# Altium schematic sheet Voltage Measurement.SchDoc
size A3
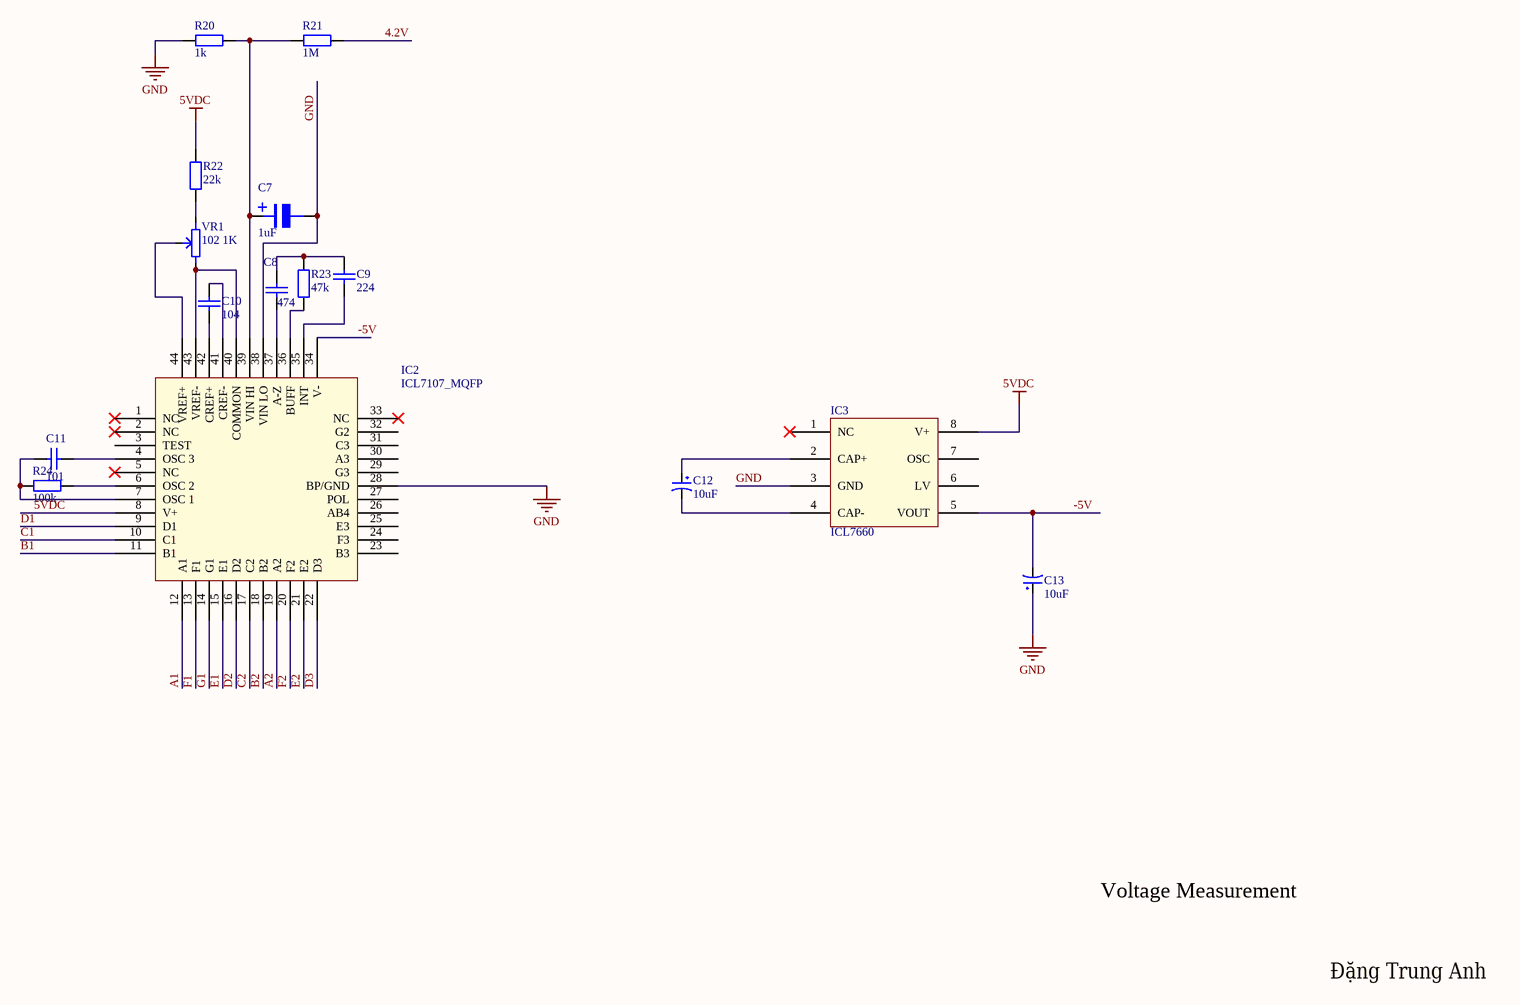
[diagram p0: Voltage Measurement.SchDoc]

## Parts
C7  1uF  [tu nhom 4 (B)]
C8  474  [tu 0805]
C9  224  [tu 0805]
C10  104  [tu 0805]
C11  101  [tu 0805]
C12  10uF  [tu hoa 4mm]
C13  10uF  [tu hoa 4mm]
IC2  ICL7107_MQFP  [ICL7107_MQFP44]
IC3  ICL7660  [SOIC8_ICL7660]
R20  1k  [tro smd 0805]
R21  1M  [tro smd 0805]
R22  22k  [tro smd 0805]
R23  47k  [tro smd 0805]
R24  100k  [tro smd 0805]
VR1  102 1K  [VR Tam Giac]

## Nets
5VDC: IC2.8(V+) IC3.8(V+) R22.2
GND: C7.2 C13.1 IC2.28(BP/GND) IC2.38(VIN_LO) IC3.3(GND) R20.2
4.2V: R21.1
-5V: C13.2 IC2.34(V-) IC3.5(VOUT)
A1: IC2.12(A1)
A2: IC2.19(A2)
B1: IC2.11(B1)
B2: IC2.18(B2)
C1: IC2.10(C1)
C2: IC2.17(C2)
D1: IC2.9(D1)
D2: IC2.16(D2)
D3: IC2.22(D3)
E1: IC2.15(E1)
E2: IC2.21(E2)
F1: IC2.13(F1)
F2: IC2.20(F2)
G1: IC2.14(G1)
NetC7_1: C7.1 IC2.39(VIN_HI) R20.1 R21.2
NetC8_1: C8.1 C9.1 R23.2
NetC8_2: C8.2 IC2.37(A-Z)
NetC9_2: C9.2 IC2.35(INT)
NetC10_1: C10.1 IC2.42(CREF+)
NetC10_2: C10.2 IC2.41(CREF-)
NetC11_1: C11.1 IC2.4(OSC_3)
NetC11_2: C11.2 IC2.7(OSC_1) R24.1
NetC12_1: C12.1 IC3.2(CAP+)
NetC12_2: C12.2 IC3.4(CAP-)
NetIC2_6: IC2.6(OSC_2) R24.2
NetIC2_36: IC2.36(BUFF) R23.1
NetIC2_40: IC2.40(COMMON) IC2.43(VREF-) VR1.1
NetIC2_44: IC2.44(VREF+) VR1.2
NetR22_1: R22.1 VR1.3

Not connected (* = marked no-connect by the designer): IC2 1(NC)* 2(NC)* 3(TEST) 5(NC)* 23(B3) 24(F3) 25(E3) 26(AB4) 27(POL) 29(G3) 30(A3) 31(C3) 32(G2) 33(NC)*; IC3 1(NC)* 6(LV) 7(OSC)

## Notes on the sheet
- Voltage Measurement
- Đặng Trung Anh
- (in symbol Tu Nhom 1uF 50V) +

## Library data of the parts
C7 = Tu Nhom 1uF 50V: Dán; Don_Vi: Con; So_Chan: 2; Ten_Linh_Kien: Tụ Nhôm 1uF 50V 4x5.4MM; Ma_Hang: MH007467; Chung_Loai: Dán; Kieu_Chan: *
C8 = Tu 0805 474 50V 10%: Dán; Don_Vi: Con; So_Chan: 2; Ten_Linh_Kien: Tụ 0805 474-470nF 50V 10%; Ma_Hang: MH006116; Chung_Loai: Dán; Kieu_Chan: *
C9 = Tu 0805 224 50V 10%: Dán; Don_Vi: Con; So_Chan: 2; Ten_Linh_Kien: Tụ 0805 224-0.22uF 10% 50V; Ma_Hang: MH004559; Chung_Loai: Dán; Kieu_Chan: *
C10 = Tu 0805 104 50V 10%: Dán; Don_Vi: Con; So_Chan: 2; Ten_Linh_Kien: Tụ 0805 104-100nF 10% 50V; Ma_Hang: MH004551; Chung_Loai: Dán; Kieu_Chan: *
C11 = Tu 0805 101 50V 20%: Dán; Don_Vi: Con; So_Chan: 2; Ten_Linh_Kien: Tụ 0805 101-0.1nF 50V 20%; Ma_Hang: MH002806; Chung_Loai: Dán; Kieu_Chan: *
C12 C13 = Tu Hoa 10uF 25V 4x7: Cắm; So_Chan: 2; Ten_Linh_Kien: Tụ Hóa 10uF 25V 4x7MM; Don_Vi: Con; Ma_Hang: MH001349; Chung_Loai: Cắm; Kieu_Chan: *
IC3 = ICL7660_SOIC8
R20 = Tro 0805 5% 1k: Dán; Don_Vi: Con; So_Chan: 2; Ten_Linh_Kien: Trở 0805 5% 1k; Ma_Hang: MH005234; Chung_Loai: Dán; Kieu_Chan: *
R21 = Tro 0805 5% 1M: Dán; Don_Vi: Con; So_Chan: 2; Ten_Linh_Kien: Trở 0805 5% 1M; Ma_Hang: MH005235; Chung_Loai: Dán; Kieu_Chan: *
R22 = Tro 0805 5% 22k: Dán; Don_Vi: Con; So_Chan: 2; Ten_Linh_Kien: Trở 0805 5% 22k; Ma_Hang: MH005248; Chung_Loai: Dán; Kieu_Chan: *
R23 = Tro 0805 5% 47k: Dán; Don_Vi: Con; So_Chan: 2; Ten_Linh_Kien: Trở 0805 5% 47k; Ma_Hang: MH005320; Chung_Loai: Dán; Kieu_Chan: *
R24 = Tro 0805 5% 100k: Dán; Don_Vi: Con; So_Chan: 2; Ten_Linh_Kien: Trở 0805 5% 100k; Ma_Hang: MH005250; Chung_Loai: Dán; Kieu_Chan: *
VR1 = Bien tro tam giac 1K: Cắm; Ten_Linh_Kien: Biến Trở Tam Giác 102-1K RM065; Don_Vi: Con; Ma_Hang: MH003709; Ghi_Chu: *; Kieu_Chan: *; Chung_Loai: Cắm